# EAGLE schematic keyboard (EAGLE 7.7.0)

## Sheet 1 of 2
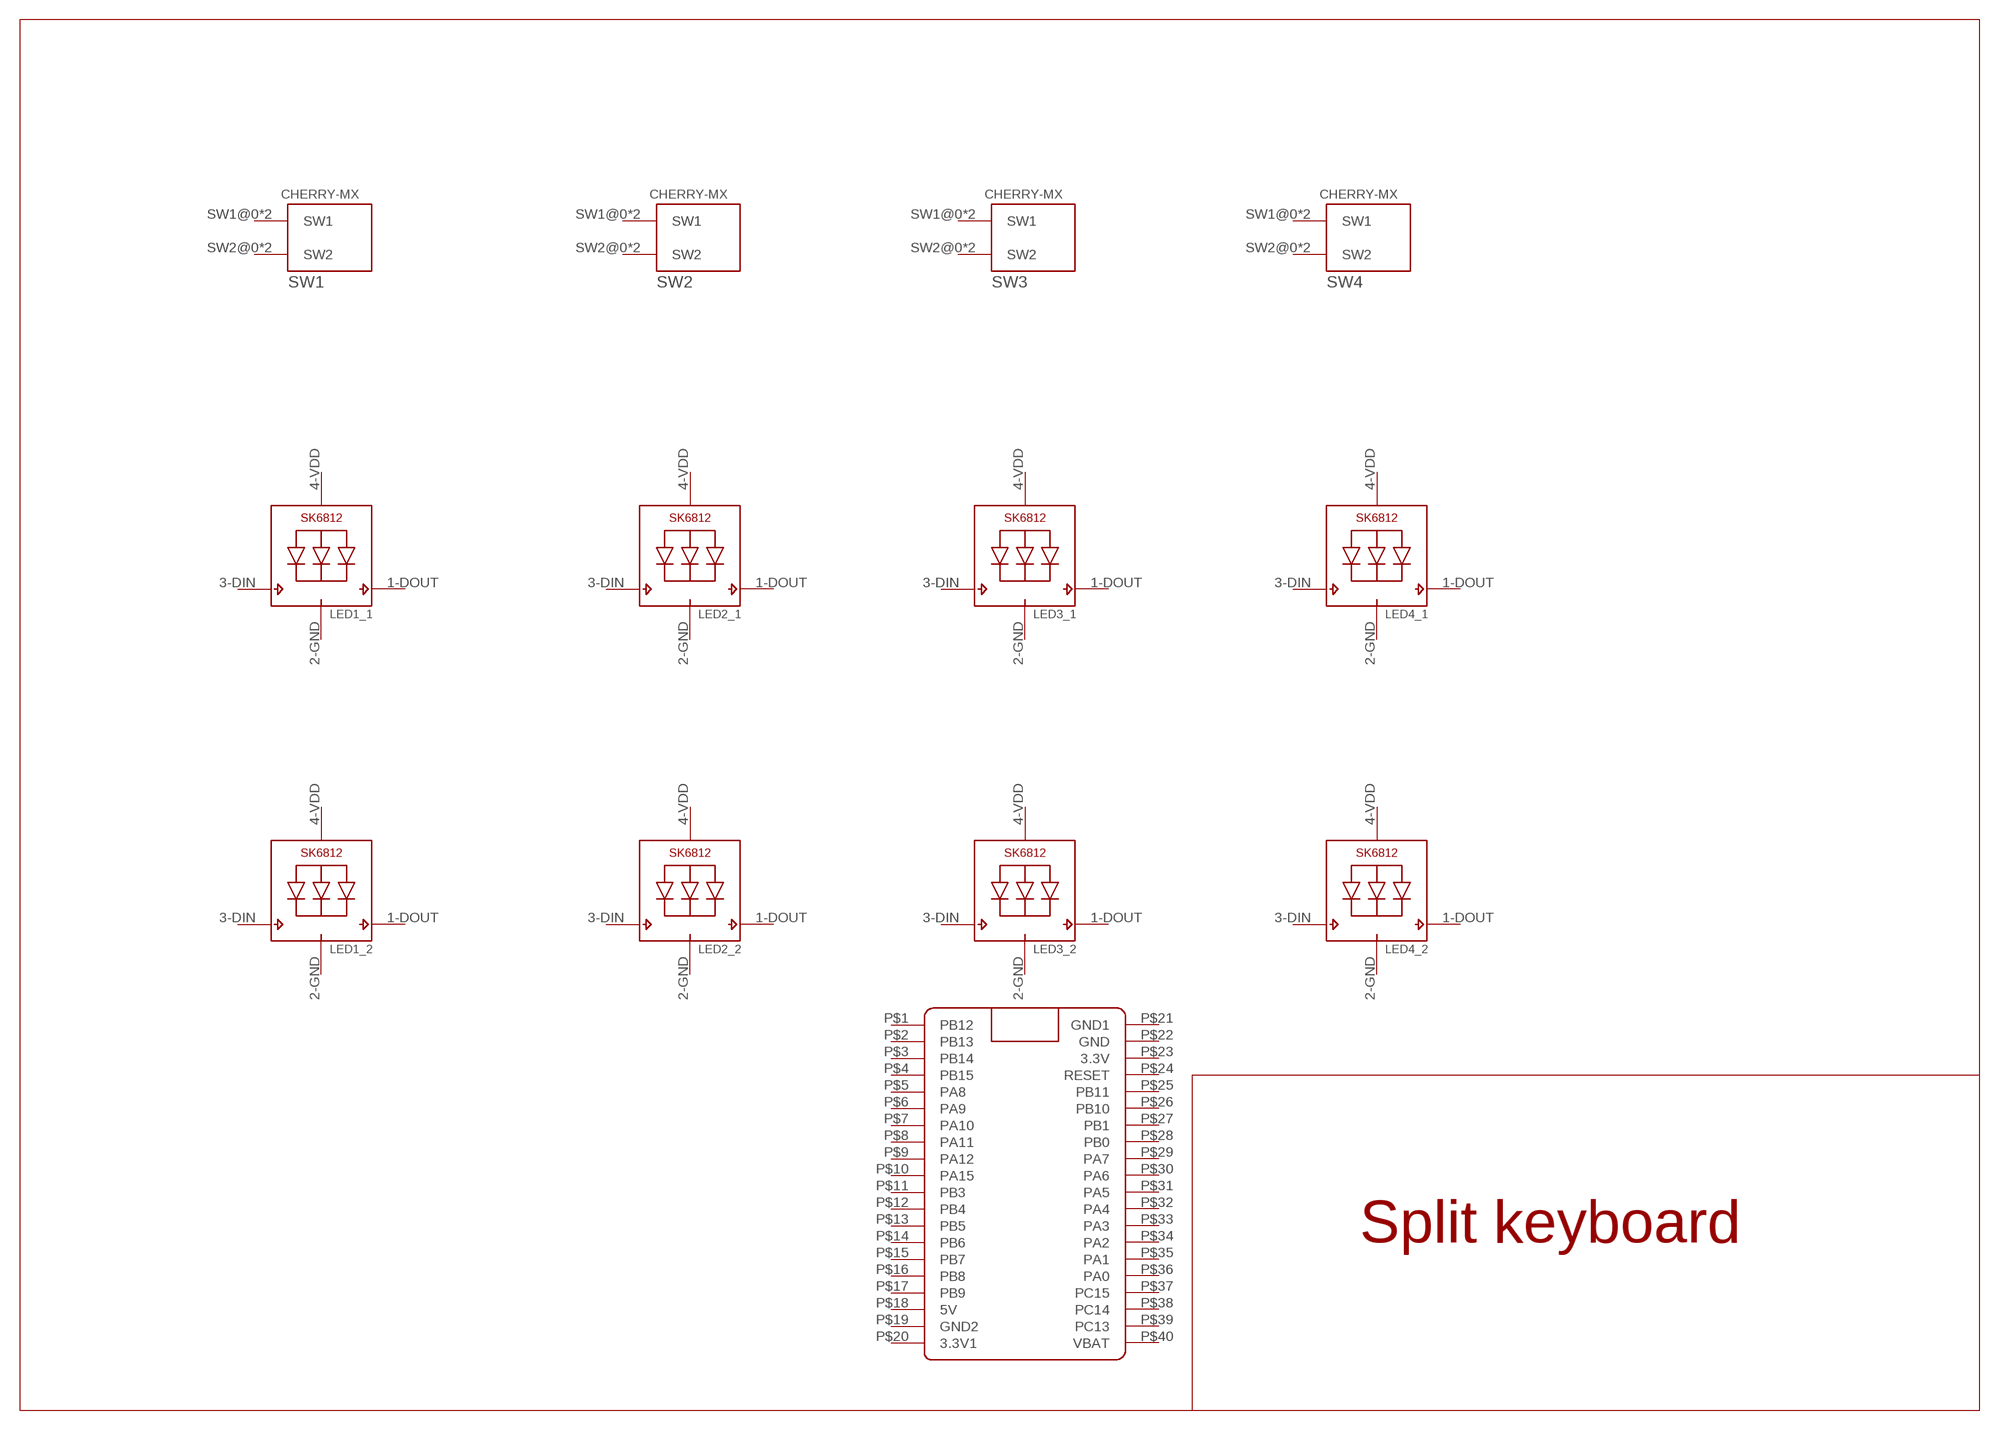
[diagram p0: schematic, sheet 1]

### Parts
LED1_1  SK6812_3535  [LED3535]
LED1_2  SK6812_3535  [LED3535]
LED2_1  SK6812_3535  [LED3535]
LED2_2  SK6812_3535  [LED3535]
LED3_1  SK6812_3535  [LED3535]
LED3_2  SK6812_3535  [LED3535]
LED4_1  SK6812_3535  [LED3535]
LED4_2  SK6812_3535  [LED3535]
MCU  BLUE_PILL  [BLUE_PILL]
SW1  CHERRY-MXSYMMETRIC  [CHERRY-MX-SYMM]
SW2  CHERRY-MXSYMMETRIC  [CHERRY-MX-SYMM]
SW3  CHERRY-MXSYMMETRIC  [CHERRY-MX-SYMM]
SW4  CHERRY-MXSYMMETRIC  [CHERRY-MX-SYMM]
Unconnected: LED1_1.1-DOUT(DO) LED1_1.3-DIN(DI) LED1_2.1-DOUT(DO) LED1_2.3-DIN(DI) LED2_1.1-DOUT(DO) LED2_1.3-DIN(DI) LED2_2.1-DOUT(DO) LED2_2.3-DIN(DI) LED3_1.1-DOUT(DO) LED3_1.3-DIN(DI) LED3_2.1-DOUT(DO) LED3_2.3-DIN(DI) LED4_1.1-DOUT(DO) LED4_1.3-DIN(DI) LED4_2.1-DOUT(DO) LED4_2.3-DIN(DI) MCU.P$1(PB12) MCU.P$2(PB13) MCU.P$3(PB14) MCU.P$4(PB15) MCU.P$5(PA8) MCU.P$6(PA9) MCU.P$7(PA10) MCU.P$8(PA11) MCU.P$9(PA12) MCU.P$10(PA15) MCU.P$11(PB3) MCU.P$12(PB4) MCU.P$13(PB5) MCU.P$14(PB6) MCU.P$15(PB7) MCU.P$16(PB8) MCU.P$17(PB9) MCU.P$18(5V) MCU.P$19(GND2) MCU.P$20(3.3V1) MCU.P$22(GND) MCU.P$23(3.3V) MCU.P$24(RESET) MCU.P$25(PB11) MCU.P$26(PB10) MCU.P$27(PB1) MCU.P$28(PB0) MCU.P$29(PA7) MCU.P$30(PA6) MCU.P$31(PA5) MCU.P$32(PA4) MCU.P$33(PA3) MCU.P$34(PA2) MCU.P$35(PA1) MCU.P$36(PA0) MCU.P$37(PC15) MCU.P$38(PC14) MCU.P$39(PC13) MCU.P$40(VBAT) SW1.SW1@0(SW1) SW1.SW1@1(SW1) SW1.SW2@0(SW2) SW1.SW2@1(SW2) SW2.SW1@0(SW1) SW2.SW1@1(SW1) SW2.SW2@0(SW2) SW2.SW2@1(SW2) SW3.SW1@0(SW1) SW3.SW1@1(SW1) SW3.SW2@0(SW2) SW3.SW2@1(SW2) SW4.SW1@0(SW1) SW4.SW1@1(SW1) SW4.SW2@0(SW2) SW4.SW2@1(SW2)

### Notes on the sheet
- Split keyboard

## Sheet 2 of 2
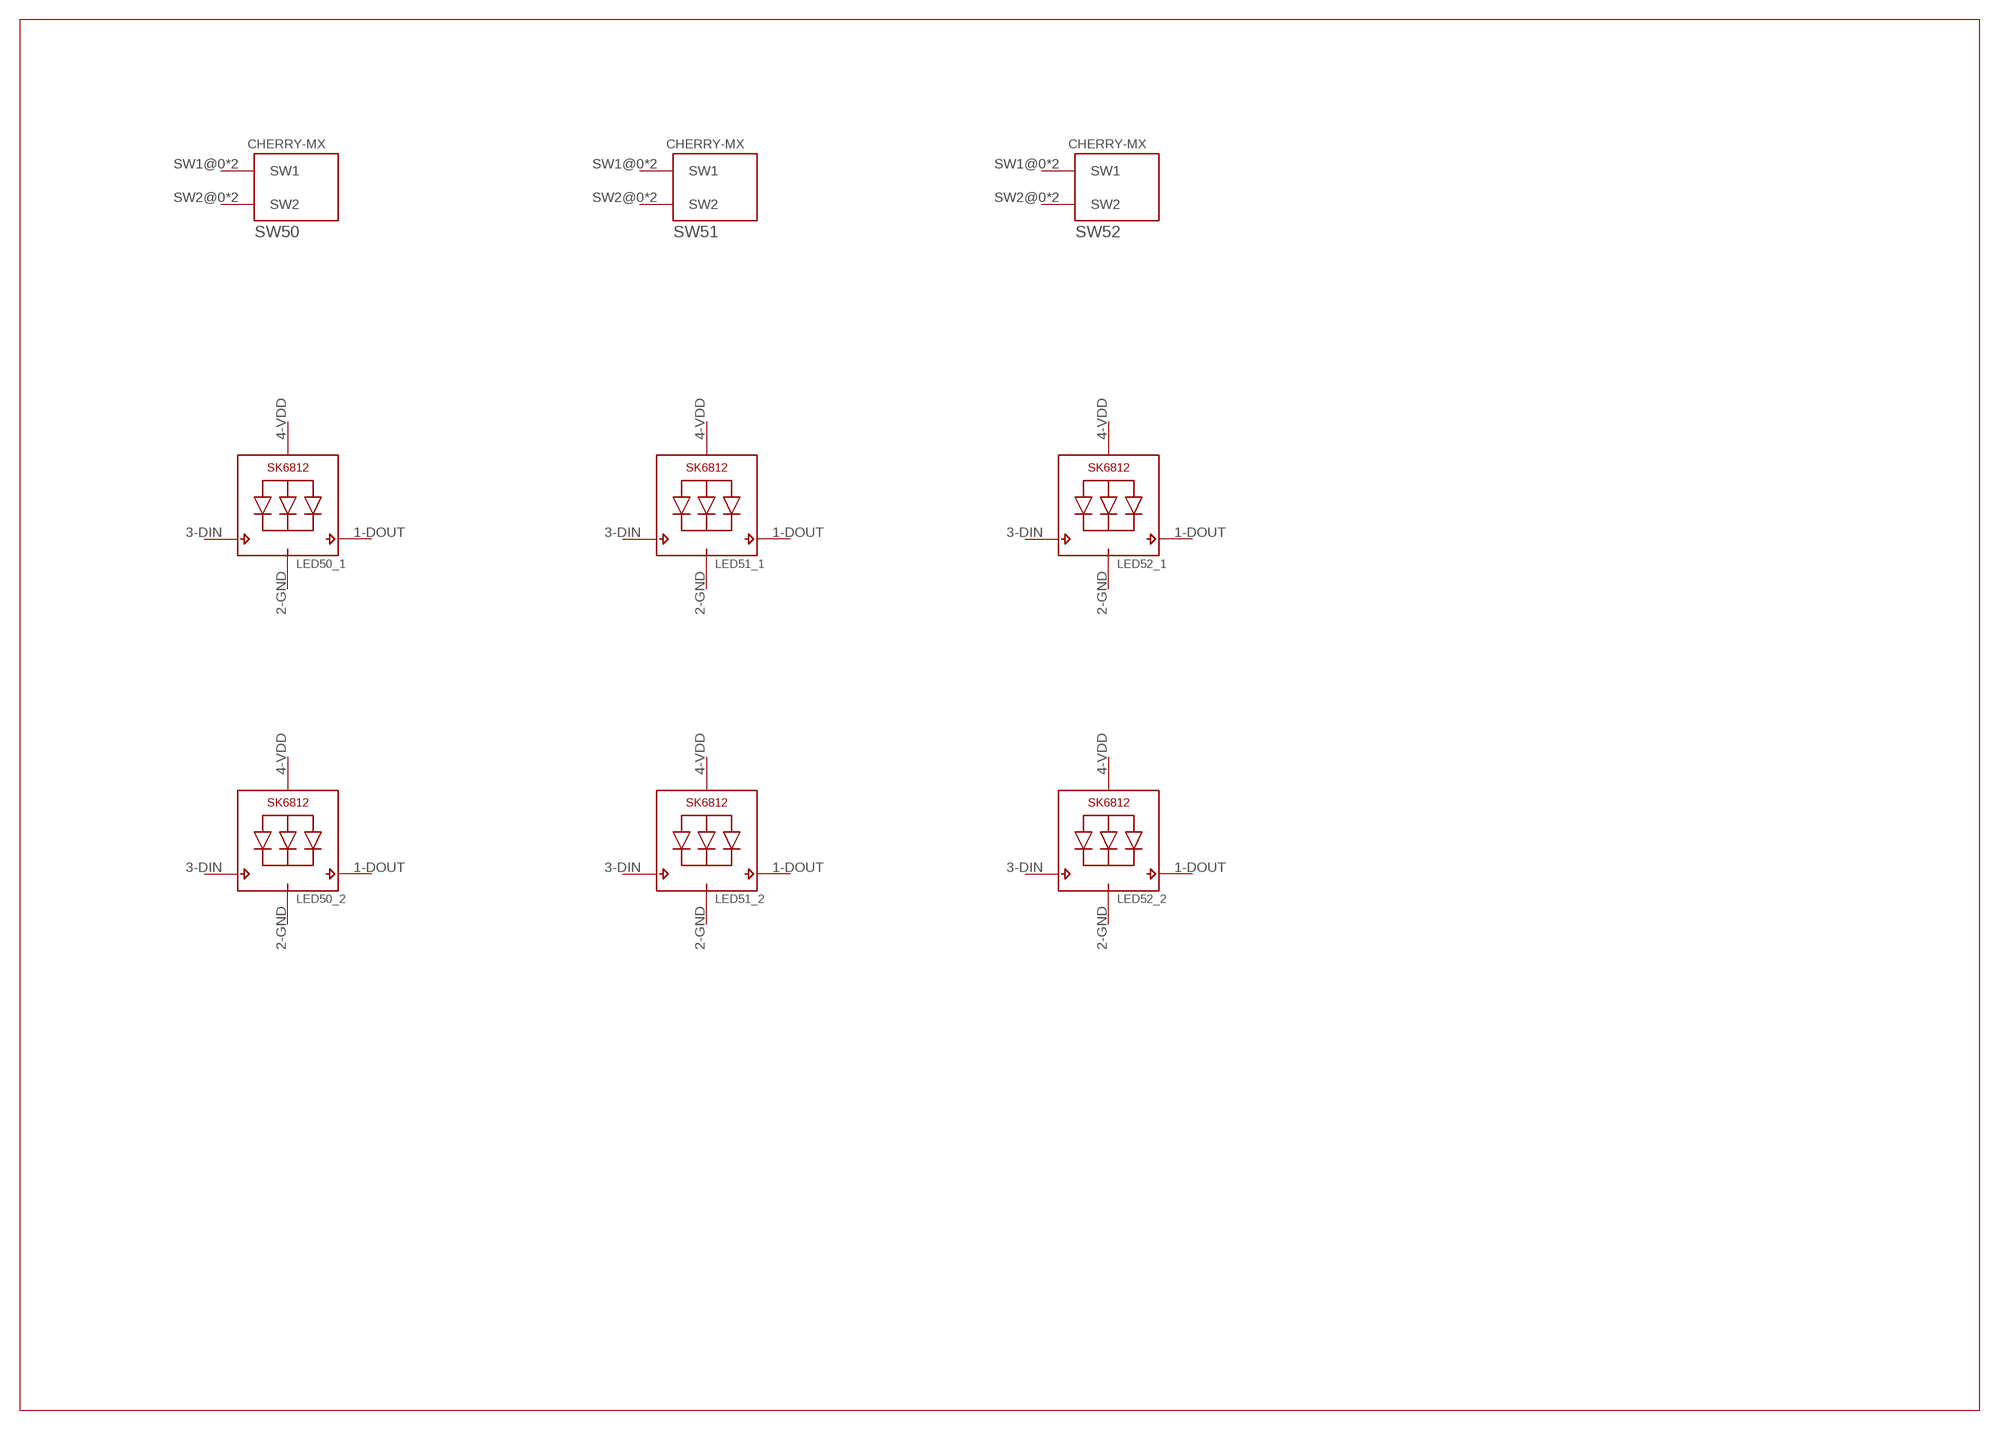
[diagram p1: schematic, sheet 2]

### Parts
LED50_1  SK6812_3535  [LED3535]
LED50_2  SK6812_3535  [LED3535]
LED51_1  SK6812_3535  [LED3535]
LED51_2  SK6812_3535  [LED3535]
LED52_1  SK6812_3535  [LED3535]
LED52_2  SK6812_3535  [LED3535]
SW50  CHERRY-MXSYMMETRIC  [CHERRY-MX-SYMM]
SW51  CHERRY-MXSYMMETRIC  [CHERRY-MX-SYMM]
SW52  CHERRY-MXSYMMETRIC  [CHERRY-MX-SYMM]
Unconnected: LED50_1.1-DOUT(DO) LED50_1.3-DIN(DI) LED50_2.1-DOUT(DO) LED50_2.3-DIN(DI) LED51_1.1-DOUT(DO) LED51_1.3-DIN(DI) LED51_2.1-DOUT(DO) LED51_2.3-DIN(DI) LED52_1.1-DOUT(DO) LED52_1.3-DIN(DI) LED52_2.1-DOUT(DO) LED52_2.3-DIN(DI) SW50.SW1@0(SW1) SW50.SW1@1(SW1) SW50.SW2@0(SW2) SW50.SW2@1(SW2) SW51.SW1@0(SW1) SW51.SW1@1(SW1) SW51.SW2@0(SW2) SW51.SW2@1(SW2) SW52.SW1@0(SW1) SW52.SW1@1(SW1) SW52.SW2@0(SW2) SW52.SW2@1(SW2)

## Power pins joined to a net without a drawn wire
GND: LED1_1.2-GND(GND) LED1_2.2-GND(GND) LED2_1.2-GND(GND) LED2_2.2-GND(GND) LED3_1.2-GND(GND) LED3_2.2-GND(GND) LED4_1.2-GND(GND) LED4_2.2-GND(GND) LED50_1.2-GND(GND) LED50_2.2-GND(GND) LED51_1.2-GND(GND) LED51_2.2-GND(GND) LED52_1.2-GND(GND) LED52_2.2-GND(GND)
GND1: MCU.P$21(GND1)
VDD: LED1_1.4-VDD(VDD) LED1_2.4-VDD(VDD) LED2_1.4-VDD(VDD) LED2_2.4-VDD(VDD) LED3_1.4-VDD(VDD) LED3_2.4-VDD(VDD) LED4_1.4-VDD(VDD) LED4_2.4-VDD(VDD) LED50_1.4-VDD(VDD) LED50_2.4-VDD(VDD) LED51_1.4-VDD(VDD) LED51_2.4-VDD(VDD) LED52_1.4-VDD(VDD) LED52_2.4-VDD(VDD)

## Library data of the parts
LED1_1 LED1_2 LED2_1 LED2_2 LED3_1 LED3_2 LED4_1 LED4_2 LED50_1 LED50_2 LED51_1 LED51_2 LED52_1 LED52_2 = SK6812:SK6812
MCU = BluePill:BLUE_PILL
SW1-SW4 SW50-SW52 = cherrymx:CHERRY-MX: Cherry MX series keyswitch